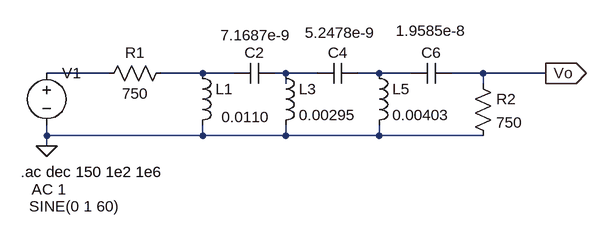
[diagram p0: schematic PassaAltasLC.asc]
PassaAltasLC.asc, the LTspice schematic file:
Version 4
SHEET 1 1832 680
WIRE 192 64 96 64
WIRE 336 64 272 64
WIRE 384 64 336 64
WIRE 464 64 448 64
WIRE 512 64 464 64
WIRE 608 64 576 64
WIRE 656 64 608 64
WIRE 768 64 720 64
WIRE 864 64 768 64
WIRE 464 80 464 64
WIRE 768 80 768 64
WIRE 96 160 96 144
WIRE 336 160 336 144
WIRE 336 160 96 160
WIRE 464 160 464 144
WIRE 464 160 336 160
WIRE 608 160 608 144
WIRE 608 160 464 160
WIRE 768 160 608 160
WIRE 96 176 96 160
FLAG 864 64 Vo
IOPIN 864 64 Out
FLAG 96 176 0
SYMBOL voltage 96 48 R0
WINDOW 123 -23 195 Left 2
WINDOW 39 0 0 Left 0
WINDOW 3 -27 221 Left 2
SYMATTR Value2 AC 1
SYMATTR Value SINE(0 1 60)
SYMATTR InstName V1
SYMBOL res 288 48 R90
WINDOW 0 0 56 VBottom 2
WINDOW 3 32 56 VTop 2
SYMATTR InstName R1
SYMATTR Value 750
SYMBOL res 752 64 R0
SYMATTR InstName R2
SYMATTR Value 750
SYMBOL cap 448 48 R90
WINDOW 0 0 32 VBottom 2
WINDOW 3 -58 30 VTop 2
SYMATTR InstName C2
SYMATTR Value 7.1687e-9
SYMBOL cap 576 48 R90
WINDOW 0 0 32 VBottom 2
WINDOW 3 -62 28 VTop 2
SYMATTR InstName C4
SYMATTR Value 5.2478e-9
SYMBOL cap 720 48 R90
WINDOW 0 0 32 VBottom 2
WINDOW 3 -65 32 VTop 2
SYMATTR InstName C6
SYMATTR Value 1.9585e-8
SYMBOL ind 320 48 R0
WINDOW 3 45 83 Left 2
SYMATTR Value 0.0110
SYMATTR InstName L1
SYMBOL ind 592 48 R0
SYMATTR InstName L5
SYMATTR Value 0.00403
SYMBOL ind 448 48 R0
SYMATTR InstName L3
SYMATTR Value 0.00295
TEXT 56 216 Left 2 !.ac dec 150 1e2 1e6

The netlist it stands for:
* PassaAltasLC.asc
V1 N001 0 SINE(0 1 60) AC 1
R1 N002 N001 750
R2 Vo 0 750
C2 N003 N002 7.1687e-9
C4 N004 N003 5.2478e-9
C6 Vo N004 1.9585e-8
L1 N002 0 0.0110
L5 N004 0 0.00403
L3 N003 0 0.00295
.ac dec 150 1e2 1e6
.backanno
.end